# EAGLE design MCU Design exp neat (EAGLE 7.1.0)
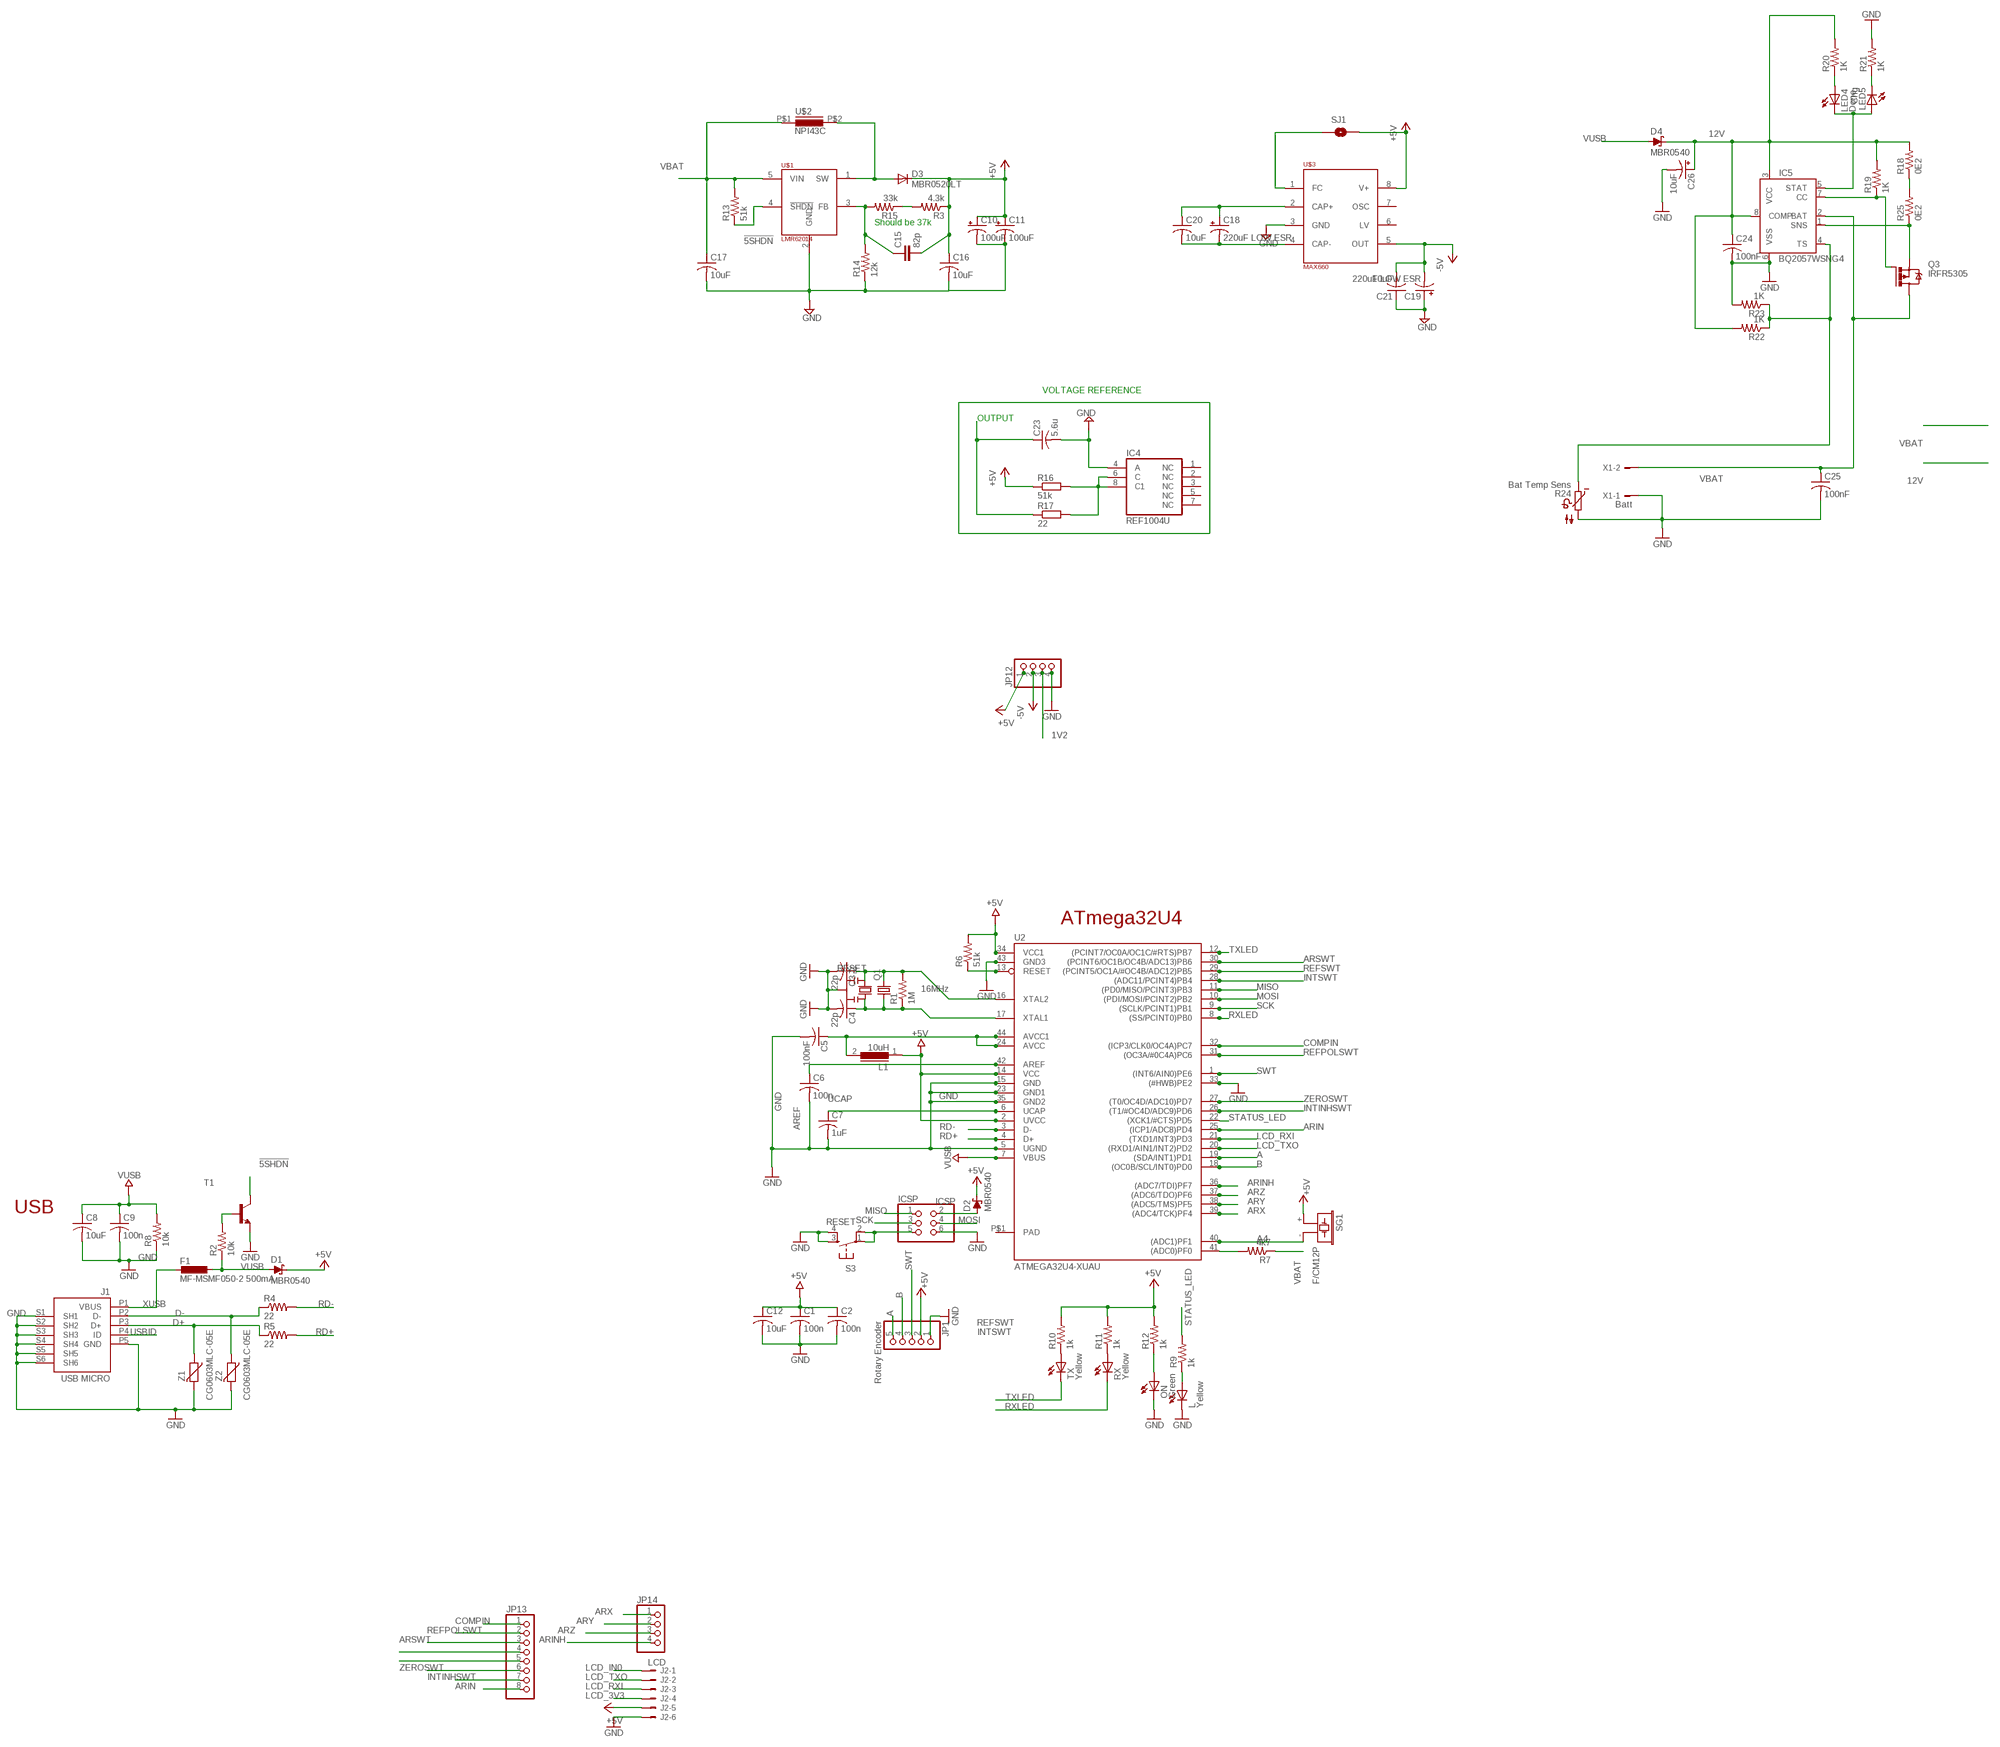
[diagram p0: schematic, sheet 1]

## Parts
C1  100n  C-USC0805  [C0805]
C2  100n  C-USC0805  [C0805]
C3  22p  C-USC0805  [C0805]
C4  22p  C-USC0805  [C0805]
C5  100nF  C-USC0805  [C0805]
C6  100n  C-USC0805  [C0805]
C7  1uF  C-USC0805  [C0805]
C8  10uF  C-USC0805  [C0805]
C9  100n  C-USC0805  [C0805]
C10  100uF  CPOL-USD  [PANASONIC_D]
C11  100uF  CPOL-USD  [PANASONIC_D]
C12  10uF  C-USC0805  [C0805]
C15  82p  C-EUC0805  [C0805]
C16  10uF  C-USC0805  [C0805]
C17  10uF  C-USC0805  [C0805]
C18  220uF LOW ESR  CPOL-USD  [PANASONIC_D]
C19  220uF LOW ESR  CPOL-USD  [PANASONIC_D]
C20  10uF  C-USC0805  [C0805]
C21  10uF  C-USC0805  [C0805]
C23  5.6u  C-USC0805K  [C0805K]
C24  100nF  C-USC0805K  [C0805K]
C25  100nF  C-USC0805K  [C0805K]
C26  10uF  CPOL-US153CLV-0405  [153CLV-0405]
D1  MBR0540  [SOD123@2]
D2  MBR0540  [SOD123@2]
D3  MBR0520LT  [SOD123]
D4  MBR0540  [SOD123@2]
F1  MF-MSMF050-2 500mA  L-EUL1812  [L1812]
IC4  REF1004U  [SO08]
IC5  BQ2057WSNG4  [D_R-PDSO-G8]
ICSP  ICSP  PINHD-2X3  [2X03]
J1  USB MICRO  MYCON2_USB-MINI-B  [CON2_USB_MICRO_B_AT]
J2  LCD  22-05-7068-06  [7395-06]
JP1  Rotary Encoder  PINHD-1X5  [1X05]
JP12  PINHD-1X4  [1X04]
JP13  PINHD-1X8  [1X08]
JP14  PINHD-1X4  [1X04]
L  Yellow  LEDCHIPLED_0805  [CHIPLED_0805]
L1  10uH  MMICC7  [MMICC7]
LED4  Done  LEDCHIPLED_0805  [CHIPLED_0805]
LED5  Chg  LEDCHIPLED_0805  [CHIPLED_0805]
ON  Green  LEDCHIPLED_0805  [CHIPLED_0805]
Q1  CRYSTALHC49UP  [HC49UP]
Q3  IRFR5305  [D-PAK_TO252AA]
R1  1M  R-US_R0805  [R0805]
R2  10k  R-US_R0805  [R0805]
R3  4.3k  R-US_R0805  [R0805]
R4  22  R-US_R0805  [R0805]
R5  22  R-US_R0805  [R0805]
R6  51k  R-US_R0805  [R0805]
R7  4k7  R-US_R0805  [R0805]
R8  10k  R-US_R0805  [R0805]
R9  1k  R-US_R0805  [R0805]
R10  1k  R-US_R0805  [R0805]
R11  1k  R-US_R0805  [R0805]
R12  1k  R-US_R0805  [R0805]
R13  51k  R-US_R0805  [R0805]
R14  12k  R-US_R0805  [R0805]
R15  33k  R-US_R0805  [R0805]
R16  51k  R-EU_M0805  [M0805]
R17  22  R-EU_M0805  [M0805]
R18  0E2  R-US_M1206  [M1206]
R19  1K  R-US_R0805  [R0805]
R20  1K  R-US_R0805  [R0805]
R21  1K  R-US_R0805  [R0805]
R22  1K  R-US_R0805  [R0805]
R23  1K  R-US_R0805  [R0805]
R24  Bat Temp Sens  NTC640  [P640]
R25  0E2  R-US_M1206  [M1206]
RX  Yellow  LEDCHIPLED_0805  [CHIPLED_0805]
S3  RESET  TAC_SWITCHSMD  [TACTILE_SWITCH_SMD]
SG1  F/CM12P  [F/CM12P]
SJ1  SOLDERJUMPERTRACE  [SJ_2S-TRACE]
T1  MMBT2222ALT1-NPN-SOT23-BEC  [SOT23-BEC]
TX  Yellow  LEDCHIPLED_0805  [CHIPLED_0805]
U2  ATMEGA32U4-XUAU  [TQFP44-PAD]
U$1  LMR62014  [SOT23-5]
U$2  NPI43C  [NPI43C]
U$3  MAX660  [SO08]
X1  Batt  22-23-2021  [22-23-2021]
Y2  16MHz  RESONATORMU  [RESONATOR]
Z1  CG0603MLC-05E  VARISTORCN0603  [CT/CN0603]
Z2  CG0603MLC-05E  VARISTORCN0603  [CT/CN0603]

## Nets
1V2: C23.1 JP12.3 R17.1
12V: C24.1 C26.+ D4.C IC5.3(VCC) IC5.8(COMP) R18.2 R19.2 R20.2 R22.2
!5SHDN: R13.1 T1.C U$1.4(!SHDN)
+5V [usbvcc]: C1.1 C2.1 C10.+ C11.+ C12.1 C15.2 C16.1 D1.C D2.C D3.C J2.5 JP1.2 JP12.1 L1.1 R3.1 R6.2 R10.2 R11.2 R12.2 R16.1 SG1.+ SJ1.2 U2.2(UVCC) U2.14(VCC) U2.34(VCC1) U$3.8(V+)
-5V: C19.- C21.2 JP12.2 U$3.5(OUT)
A: JP1.5 U2.19((SDA/INT1)PD1)
A4: SG1.- U2.40((ADC1)PF1)
AREF [aref]: C6.1 U2.42(AREF)
ARIN: JP13.8 U2.25((ICP1/ADC8)PD4)
ARINH: JP14.4 U2.36((ADC7/TDI)PF7)
ARSWT: JP13.3 U2.30((PCINT6/OC1B/OC4B/ADC13)PB6)
ARX: JP14.1 U2.39((ADC4/TCK)PF4)
ARY: JP14.2 U2.38((ADC5/TMS)PF5)
ARZ: JP14.3 U2.37((ADC6/TDO)PF6)
AVCC: C5.1 L1.2 U2.24(AVCC) U2.44(AVCC1)
B: JP1.4 U2.18((OC0B/SCL/INT0)PD0)
COMPIN: JP13.1 U2.32((ICP3/CLK0/OC4A)PC7)
D+: J1.P3(D+) R5.1 Z1.1
D-: J1.P2(D-) R4.1 Z2.1
GND [gnd]: C1.2 C2.2 C3.2 C4.2 C5.2 C6.2 C7.2 C8.2 C9.2 C10.- C11.- C12.2 C16.2 C17.2 C19.+ C21.1 C23.2 C24.2 C25.2 C26.- IC4.4(A) IC5.6(VSS) ICSP.6 J1.P5(GND) J1.S1(SH1) J1.S2(SH2) J1.S3(SH3) J1.S4(SH4) J1.S5(SH5) J1.S6(SH6) J2.6 JP1.1 JP12.4 L.C ON.C R8.1 R14.1 R21.2 R23.2 R24.2 S3.3 S3.4 T1.E U2.5(UGND) U2.15(GND) U2.23(GND1) U2.33((#HWB)PE2) U2.35(GND2) U2.43(GND3) U$1.2(GND) U$3.3(GND) X1.1 Y2.2 Z1.2 Z2.2
INTINHSWT: JP13.7 U2.26((T1/#OC4D/ADC9)PD6)
INTSWT: JP13.5 U2.28((ADC11/PCINT4)PB4)
LCD_3V3: J2.4
LCD_IN0: J2.1
LCD_RXI: J2.3 U2.21((TXD1/INT3)PD3)
LCD_TXO: J2.2 U2.20((RXD1/AIN1/INT2)PD2)
MISO: ICSP.1 U2.11((PD0/MISO/PCINT3)PB3)
MOSI: ICSP.4 U2.10((PDI/MOSI/PCINT2)PB2)
N$1: R10.1 TX.A
N$2: L.A R9.1
N$3: ON.A R12.1
N$4: R11.1 RX.A
N$5: C18.+ C20.1 U$3.2(CAP+)
N$6: R7.2 U2.41((ADC0)PF0)
N$7: IC4.6(C) IC4.8(C1) R16.2 R17.2
N$8: R2.2 T1.B
N$10 [usbvcc]: D2.A ICSP.2
N$11: R3.2 R15.1
N$12: IC5.5(STAT) LED4.C LED5.A
N$14: LED4.A R20.1
N$15: R18.1 R25.2
N$16: C18.- C20.2 U$3.4(CAP-)
N$17: C15.1 R14.2 R15.2 U$1.3(FB)
N$19: SJ1.1 U$3.1(FC)
N$23: ICSP.5 S3.1 S3.2
N$27: IC5.1(SNS) Q3.3(S) R25.1
N$29: IC5.7(CC) Q3.1(G) R19.1
N$30: LED5.C R21.1
N$32: IC5.4(TS) R22.1 R23.1 R24.1
RD+: R5.2 U2.4(D+)
RD-: R4.2 U2.3(D-)
REFPOLSWT: JP13.2 U2.31((OC3A/#0C4A)PC6)
REFSWT: JP13.4 U2.29((PCINT5/OC1A/#OC4B/ADC12)PB5)
RESET: R6.1 U2.13(RESET)
RXLED: RX.C U2.8((SS/PCINT0)PB0)
SCK: ICSP.3 U2.9((SCLK/PCINT1)PB1)
STATUS_LED: R9.2 U2.22((XCK1/#CTS)PD5)
SW: D3.A U$1.1(SW) U$2.P$2
SWT: JP1.3 U2.1((INT6/AIN0)PE6)
TXLED: TX.C U2.12((PCINT7/OC0A/OC1C/#RTS)PB7)
UCAP: C7.1 U2.6(UCAP)
USBID: J1.P4(ID)
VBAT: C17.1 C25.1 IC5.2(BAT) Q3.4(D) R7.1 R13.2 U$1.5(VIN) U$2.P$1 X1.2
VUSB: C8.1 C9.1 D1.A D4.A F1.1 R2.1 R8.2 U2.7(VBUS)
XTAL1: C4.1 Q1.1 R1.1 U2.17(XTAL1) Y2.3
XTAL2: C3.1 Q1.2 R1.2 U2.16(XTAL2) Y2.1
XUSB [usbvcc]: F1.2 J1.P1(VBUS)
ZEROSWT: JP13.6 U2.27((T0/OC4D/ADC10)PD7)
Unconnected: IC4.1(NC) IC4.2(NC) IC4.3(NC) IC4.5(NC) IC4.7(NC) U$3.6(LV) U$3.7(OSC)

## Notes on the sheet
- Should be 37k
- VOLTAGE REFERENCE
- OUTPUT
- ATmega32U4
- USB

## Power pins joined to a net without a drawn wire
PAD: U2.P$1(PAD)

## Library data of the parts
C1-C9 C12 C16 C17 C20 C21 C24 C25 = resistor:C-US: CAPACITOR, American symbol
C10 C11 C18 C19 C26 = resistor:CPOL-US: POLARIZED CAPACITOR, American symbol
C15 = resistor:C-EU: CAPACITOR, European symbol
C23 = rcl:C-US: CAPACITOR, American symbol
D1 D2 D4 = diode:MBR0540: schottky diode, 0.5A, 40V ON Semiconductor
D3 = diode:MBR0520LT: SCHOTTKY BARRIER RECTIFIER Source: http://onsemi.com .. MBR0520LT1-D.pdf
F1 = rcl:L-EU: INDUCTOR, European symbol
IC4 = burr-brown:REF1004: Micropower Voltage Reference; MF: TEXAS INSTRUMENTS; MPN: REF1004C-1.2; OC_FARNELL: 1296022; OC_NEWARK: 75C7399
IC5 = RobThePyro:BQ2057WSNG4: TI BQ2057WSNG4 1-2Cell Li-ion / lipo charger IC http://www.ti.com/lit/ds/symlink/bq2057w.pdf
ICSP = SmartPrj:PINHD-2X3: PIN HEADER
J1 = SmartPrj:MYCON2_USB-MINI-B
J2 = con-molex:22-?-06: CONNECTOR wire to board 2.54 mm (.1 inch) pitch header; OC_FARNELL: unknown; OC_NEWARK: unknown
JP1 = pinhead:PINHD-1X5: PIN HEADER
JP12 JP14 = pinhead:PINHD-1X4: PIN HEADER
JP13 = pinhead:PINHD-1X8: PIN HEADER
L LED4 LED5 ON RX TX = led:LED: LED OSRAM: - CHIPLED LG R971, LG N971, LY N971, LG Q971, LY Q971, LO R971, LY R971 LH N974, LH R974 LS Q976, LO Q976, LY Q976 LO Q996 - Hyper CHIPLED LW Q18S LB Q993, LB Q99A, LB R99A - SideLED LS A670, LO A670, LY A670, LG A670, LP A670 LB A673, LV A673, LT A673, LW A673 LH A674 LY A675 LS A676, LA A676, LO A676, LY A676, LW A676 LS A679, LY A679, LG A679 - Hyper Micro SIDELED® LS Y876, LA Y876, LO Y876, LY Y876 LT Y87S - SmartLED LW L88C, LW L88S LB L89C, LB L89S, LG L890 LS L89K, LO L89K, LY L89K LS L896, LA L896, LO L896, LY L896 - TOPLED LS T670, LO T670, LY T670, LG T670, LP T670 LSG T670, LSP T670, LSY T670, LOP T670, LYG T670 LG T671, LOG T671, LSG T671 LB T673, LV T673, LT T673, LW T673 LH T674 LS T676, LA T676, LO T676, LY T676, LB T676, LH T676, LSB T676, LW T676 LB T67C, LV T67C, LT T67C, LS T67K, LO T67K, LY T67K, LW E67C LS E67B, LA E67B, LO E67B, LY E67B, LB E67C, LV E67C, LT E67C LW T67C LS T679, LY T679, LG T679 LS T770, LO T770, LY T770, LG T770, LP T770 LB T773, LV T773, LT T773, LW T773 LH T774 LS E675, LA E675, LY E675, LS T675 LS T776, LA T776, LO T776, LY T776, LB T776 LHGB T686 LT T68C, LB T68C - Hyper Mini TOPLED® LB M676 - Mini TOPLED Santana® LG M470 LS M47K, LO M47K, LY M47K Source: http://www.osram.convergy.de LUXEON: - LUMILED® LXK2-PW12-R00, LXK2-PW12-S00, LXK2-PW14-U00, LXK2-PW14-V00 LXK2-PM12-R00, LXK2-PM12-S00, LXK2-PM14-U00 LXK2-PE12-Q00, LXK2-PE12-R00, LXK2-PE12-S00, LXK2-PE14-T00, LXK2-PE14-U00 LXK2-PB12-K00, LXK2-PB12-L00, LXK2-PB12-M00, LXK2-PB14-N00, LXK2-PB14-P00, LXK2-PB14-Q00 LXK2-PR12-L00, LXK2-PR12-M00, LXK2-PR14-Q00, LXK2-PR14-R00 LXK2-PD12-Q00, LXK2-PD12-R00, LXK2-PD12-S00 LXK2-PH12-R00, LXK2-PH12-S00 LXK2-PL12-P00, LXK2-PL12-Q00, LXK2-PL12-R00 Source: www.luxeon.com KINGBRIGHT: KA-3528ASYC Source: www.kingbright.com
L1 = inductors:MMICC7: INDUCTOR
Q1 = crystal:CRYSTAL: CRYSTAL; OC_FARNELL: unknown; OC_NEWARK: unknown
Q3 = transistor-power:IRF?5305: HEXFET Power MOSFET Source: http://www.irf.com/product-info/datasheets/data/irfr5305pbf.pdf
R1-R15 R18-R23 R25 = resistor:R-US_: RESISTOR, American symbol
R16 R17 = resistor:R-EU_: RESISTOR, European symbol
R24 = ptc-ntc:NTC640: PHILIPS NTC; OC_FARNELL: unknown; OC_NEWARK: unknown
S3 = SparkFun:TAC_SWITCH: Momentary Switch Button commonly used for reset or general input. Spark Fun Electronics SKU : COM-00097
SG1 = buzzer:F/CM12P: BUZZER Source: Buerklin; OC_FARNELL: unknown; OC_NEWARK: unknown
SJ1 = SparkFun:SOLDERJUMPER: Solder Jumper Standard SMD solder jumper. Used to automate production. Two varients : Normally Open and Normally Closed are the same, but have different paste layers. NC will have a large amount of paste and should jumper during reflow.
T1 = transistor-neu-to92:*-NPN-: NPN Transistror
U2 = SmartPrj:ATMEGA32U4-XU
U$1 = RobThePyro:LMR62014
U$2 = RobThePyro:NPI43C
U$3 = RobThePyro:MAX660
X1 = con-molex:22-23-2021: .100" (2.54mm) Center Header - 2 Pin; MF: MOLEX; MPN: 22-23-2021; OC_FARNELL: 1462926; OC_NEWARK: 25C3832
Y2 = SmartPrj:RESONATOR
Z1 Z2 = varistor:VARISTOR: VARISTOR

## Net classes
0 default: width 0.152 mm, drill 0.305 mm, clearance 0.152 mm
1 power: width 0.254 mm, drill 0.61 mm, clearance 0.254 mm
2 gnd: width 0.254 mm, drill 0.61 mm, clearance 0.254 mm
3 usbvcc: width 0.254 mm, drill 0.61 mm, clearance 0.254 mm
4 aref: width 0.254 mm, drill 0.61 mm, clearance 0.254 mm

## Board
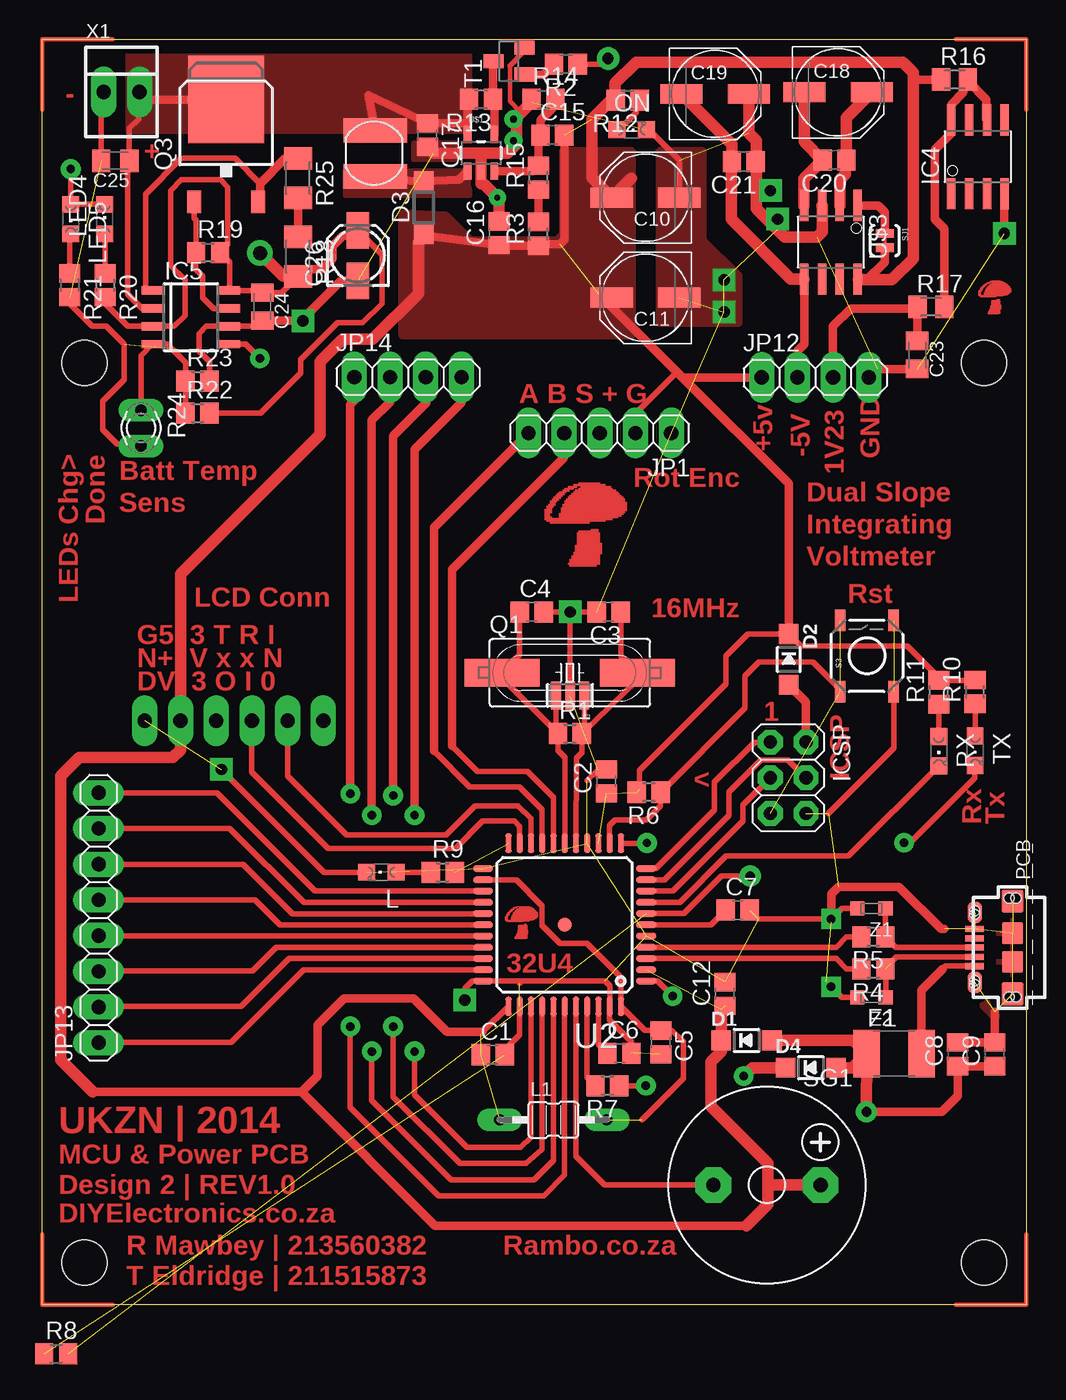
[diagram p1: board, top side]
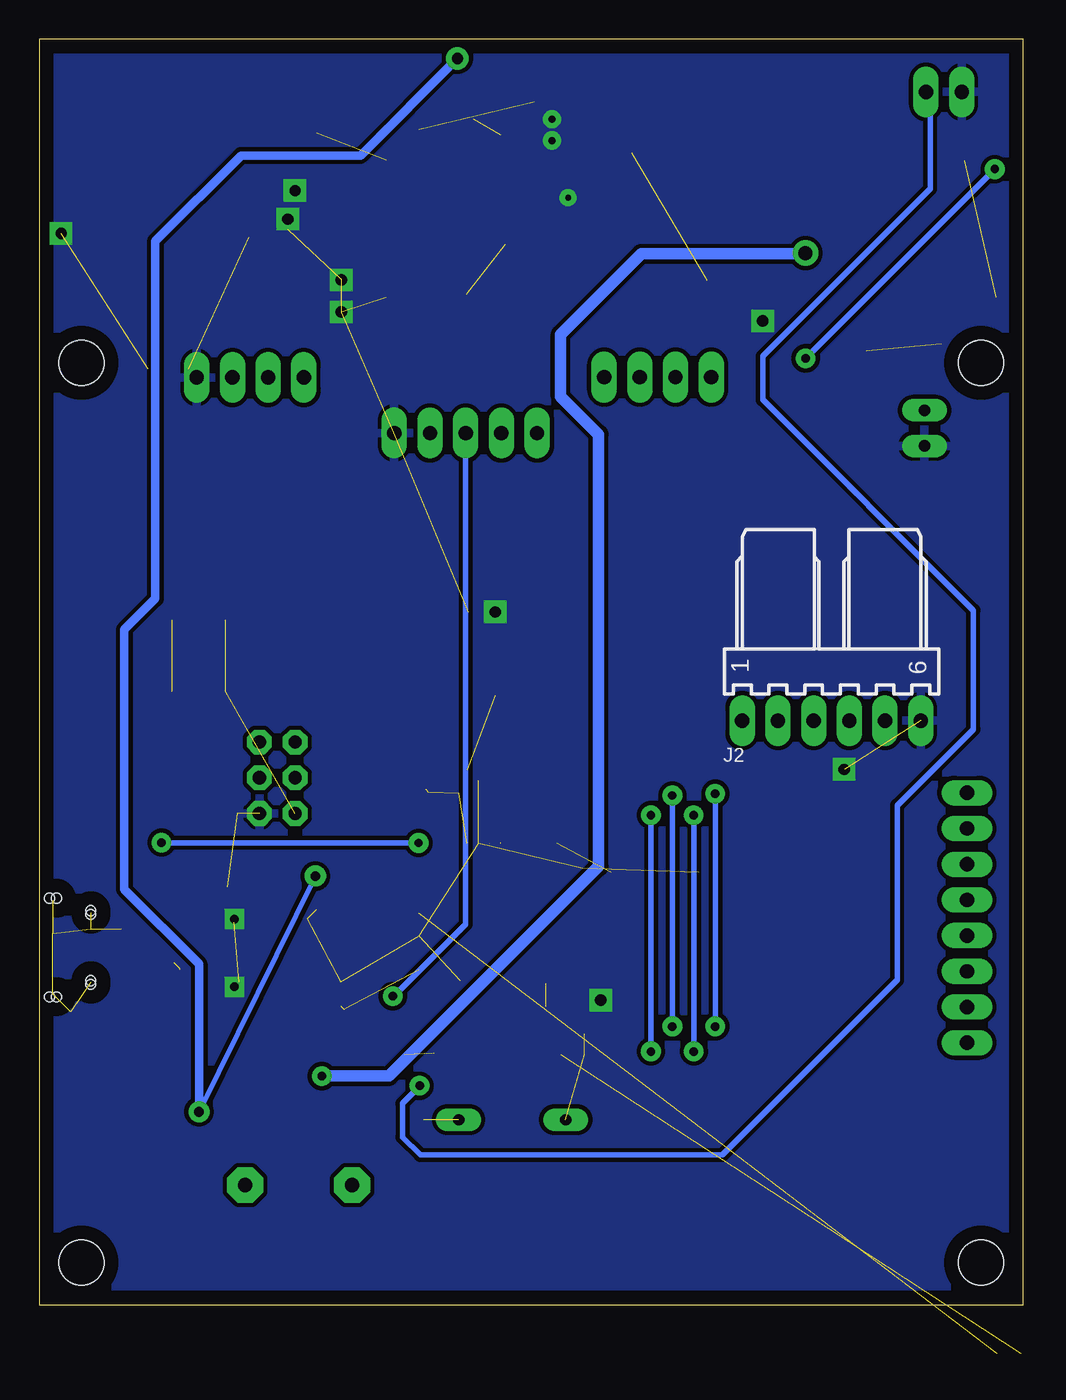
[diagram p2: board, bottom side, seen from below]

Size 70 x 90 mm. Coordinates in mm from the lower left corner, seen from the top.
Outline: 0,0 0,90 70,90 70,0 0,0
Copper layers (1*16): Top 0.035mm / dielectric 1.5mm / Bottom 0.035mm
Design rules "RobThePyro_home *": minimum track width 0.4mm, minimum drill 0.6mm, track to track 0.3mm, track to pad 0.2mm, pad to pad 0.3mm, via to via 0.3mm, smd to smd 8mil, copper to edge 40mil, drill to drill 8mil, minimum pad ring 0.4mm, minimum via ring 0.4mm, stop-mask expansion 4mil, vias tented up to drill 0mil, thermal gap 10mil
Holes 3.2 mm at 3,3 67,3 67,67 3,67

### Footprints (pad centres in the part's own frame; a part is rotated, then mirrored left to right if it is on the bottom)
C0805 = smd 1.3 x 1.5: 1 -0.85,0; 2 0.85,0
PANASONIC_D = smd 3 x 1.4: + 2.4,0; - -2.4,0
C0805K = smd 1.3 x 1.6: 1 -1,0; 2 1,0
153CLV-0405 = smd 2.6 x 1.6: + 1.8,0; - -1.8,0
SOD123@2 = smd 1.4 x 1.4: A 1.805,0; C -1.805,0
SOD123 = smd 1.4 x 1.4: A 1.9,0; C -1.9,0
L1812 = smd 1.9 x 3.4: 1 -1.95,0; 2 1.95,0
SO08 = smd 0.61 x 2.21: 1 -1.905,-2.616; 2 -0.635,-2.616; 3 0.635,-2.616; 4 1.905,-2.616; 5 1.905,2.616; 6 0.635,2.616; 7 -0.635,2.616; 8 -1.905,2.616
D_R-PDSO-G8 = smd 0.6 x 1.5: 1 -1.905,-2.75; 2 -0.635,-2.75; 3 0.635,-2.75; 4 1.905,-2.75; 5 1.905,2.75; 6 0.635,2.75; 7 -0.635,2.75; 8 -1.905,2.75
2X03 = drill 0.95 pad 1.55 octagon: 1 -2.54,-1.27; 2 -2.54,1.27; 3 0,-1.27; 4 0,1.27; 5 2.54,-1.27; 6 2.54,1.27
CON2_USB_MICRO_B_AT = smd 0.406 x 1.346: P1 -1.321,2.692; P2 -0.66,2.692; P3 0,2.692; P4 0.66,2.692; P5 1.321,2.692 | smd 1.651 x 1.549: S1 -3.302,0; S2 3.302,0 | smd 1.524 x 1.016: S3 -2.489,2.692; S4 2.489,2.692 | smd 1.524 x 1.524: S5 -1.016,0; S6 1.016,0 | hole 0.7: -3.505,0.254; -3.505,-0.254; 3.505,0.254; 3.505,-0.254; -2.616,2.692; -2.362,2.692; 2.362,2.692; 2.616,2.692
7395-06 = drill 1.016 long: 1 6.35,0; 2 3.81,0; 3 1.27,0; 4 -1.27,0; 5 -3.81,0; 6 -6.35,0
1X05 = drill 1.016 long: 1 -5.08,0; 2 -2.54,0; 3 0,0; 4 2.54,0; 5 5.08,0
1X04 = drill 1.016 long: 1 -3.81,0; 2 -1.27,0; 3 1.27,0; 4 3.81,0
1X08 = drill 1.016 long: 1 -8.89,0; 2 -6.35,0; 3 -3.81,0; 4 -1.27,0; 5 1.27,0; 6 3.81,0; 7 6.35,0; 8 8.89,0
CHIPLED_0805 = smd 1.2 x 1.2: A 0,-1.05; C 0,1.05
MMICC7 = drill 0.813 long: 1 -3.81,0; 2 3.81,0
HC49UP = smd 5.334 x 1.93: 1 -4.826,0; 2 4.826,0
D-PAK_TO252AA = smd 1 x 1.6: 1 -2.28,-4.8; 3 2.28,-4.8 | smd 5.4 x 6.2: 4 0,2.5
R0805 = smd 1.3 x 1.5: 1 -0.85,0; 2 0.85,0
M0805 = smd 1.3 x 1.6: 1 -0.95,0; 2 0.95,0
M1206 = smd 1.6 x 2: 1 -1.4,0; 2 1.4,0
P640 = drill 0.813 long: 1 -1.27,0; 2 1.27,0
TACTILE_SWITCH_SMD = smd 1.524 x 0.762: 1 -2.54,1.905; 2 2.54,1.905; 3 -2.54,-1.905; 4 2.54,-1.905
F/CM12P = drill 1.016 pad 2.54 octagon: + 3.81,0; - -3.81,0
SJ_2S-TRACE = smd 0.635 x 1.27: 1 -0.508,0; 2 0.508,0
SOT23-BEC = smd 1 x 1.4: B -0.95,-1.1; C 0,1.1; E 0.95,-1.1
TQFP44-PAD = smd 1.4 x 0.45: 1 -5.8,4; 2 -5.8,3.2; 3 -5.8,2.4; 4 -5.8,1.6; 5 -5.8,0.8; 6 -5.8,0; 7 -5.8,-0.8; 8 -5.8,-1.6; 9 -5.8,-2.4; 10 -5.8,-3.2; 11 -5.8,-4; 23 5.8,-4; 24 5.8,-3.2; 25 5.8,-2.4; 26 5.8,-1.6; 27 5.8,-0.8; 28 5.8,0; 29 5.8,0.8; 30 5.8,1.6; 31 5.8,2.4; 32 5.8,3.2; 33 5.8,4 | smd 0.45 x 1.4: 12 -4,-5.8; 13 -3.2,-5.8; 14 -2.4,-5.8; 15 -1.6,-5.8; 16 -0.8,-5.8; 17 0,-5.8; 18 0.8,-5.8; 19 1.6,-5.8; 20 2.4,-5.8; 21 3.2,-5.8; 22 4,-5.8; 34 4,5.8; 35 3.2,5.8; 36 2.4,5.8; 37 1.6,5.8; 38 0.8,5.8; 39 0,5.8; 40 -0.8,5.8; 41 -1.6,5.8; 42 -2.4,5.8; 43 -3.2,5.8; 44 -4,5.8 | smd 1 x 1: P$1 0,0
SOT23-5 = smd 0.55 x 1.2: 1 -0.95,-1.3; 2 0,-1.3; 3 0.95,-1.3; 4 0.95,1.3; 5 -0.95,1.3
NPI43C = smd 1.75 x 4.5: P$1 -1.61,0.1; P$2 1.66,0.1
22-23-2021 = drill 1 long: 1 -1.27,0; 2 1.27,0
RESONATOR = smd 0.7 x 2: 1 -1,0; 2 0,0; 3 1,0
CT/CN0603 = smd 1 x 1: 1 -1,0; 2 1,0

### Placement (x,y rotation side)
C1  32.06,17.78 0 top
C2  40.13,37.21 90 top
C3  40.31,49.28 180 top
C4  34.82,49.28 0 top
C5  44.02,18.64 270 top
C6  41.07,17.88 0 top
C7  49.48,28.07 0 top
C8  65.13,17.81 90 top
C9  67.77,17.81 90 top
C10  42.93,78.74 180 top
C11  42.93,71.63 180 top
C12  48.57,22.1 90 top
C15  36.3,83.19 0 top
C16  32.49,76.21 90 top
C17  27.41,83.19 270 top
C18  56.62,86.24 0 top
C19  47.89,86.13 0 top
C20  56.36,81.41 180 top
C21  49.92,81.3 180 top
C23  62.25,67.56 270 top
C24  15.66,70.99 270 top
C25  5.21,81.36 180 top
C26  22.46,74.63 90 top
D1  50.11,18.8 0 top
D2  53.11,45.9 270 top
D3  27.15,78.03 90 top
D4  54.69,16.86 0 top
F1  60.6,17.86 0 top
IC4  66.57,81.65 0 top
IC5  10.58,70.23 270 top
ICSP  53.08,37.48 270 top
J1  69.04,25.4 90 top
J2  13.65,41.54 180 bottom
JP1  39.67,62 180 top
JP12  55,65.96 0 top
JP13  4.02,27.52 90 top
JP14  26.02,65.98 0 top
L  24.14,30.76 90 top
L1  36.37,13.14 0 top
LED4  4.45,77.22 0 top
LED5  2.03,77.22 180 top
ON  41.95,83.56 270 top
Q1  37.54,44.95 0 top
Q3  13.08,83.23 0 top
R1  37.54,40.61 0 top
R2  37.26,88.25 180 top
R3  35.31,76.16 90 top
R4  59.13,23.88 180 top
R5  59.13,26.16 180 top
R6  43.16,36.45 180 top
R7  40.21,15.57 180 top
R8  1,-3.5 0 top  (outside the outline)
R9  28.5,30.75 0 top
R10  66.37,43.59 90 top
R11  63.78,43.56 90 top
R12  41.66,85.68 180 top
R13  31.22,85.73 180 top
R14  35.66,85.73 0 top
R15  35.31,80.16 90 top
R16  64.9,87.15 0 top
R17  63.24,70.97 0 top
R18  18.2,74.55 270 top
R19  11.81,74.85 0 top
R20  4.49,72.52 270 top
R21  1.95,72.52 270 top
R22  11.05,63.42 0 top
R23  11.05,65.7 0 top
R24  7.03,62.36 270 top
R25  18.2,80.14 270 top
RX  63.78,39.37 180 top
S3  58.67,46.15 90 top
SG1  51.56,8.51 0 top
SJ1  59.94,75.69 270 top
T1  33.21,88.46 90 top
TX  66.37,39.4 180 top
U2  37.17,27.02 180 top
U$1  31.22,81.92 0 top
U$2  23.6,81.92 270 top
U$3  56.11,75.57 180 top
X1  5.65,86.26 0 top
Y2  37.57,43.33 180 top
Z1  59.01,28.19 180 top
Z2  59.01,21.84 180 top

### Tracks (layer width: path | path; a pad name or v marks a point on that pad's centre or on a via)
1V2
  Top 0.61: JP12.3 56.26,69.6 57.53,70.87 62.19,70.87 R17.1 62.25,70.94 C23.1
12V  (via drill 0.6, 1)
  Top 0.406: 12.7,74.88 R19.2 | R19.2 13.33,74.17 IC5.8 15.52,72.14 C24.1 17.05,71.99 R18.2 | R19.2 13.21,75.39 13.21,79.5 12.7,80.01 9.91,80.01 9.14,79.25 9.14,73.91 10.16,72.9 10.16,70.36 9.4,69.59 IC5.3 6.1,69.6 4.49,71.2 R20.2 | R22.2 15.54,63.42 18.39,66.27 18.39,67.26 18.41,67.26 21.01,69.85 22.81,69.85 24.18,71.22 24.18,74.71 22.84,76.05
  Top 0.61: C26.+ 22.84,76.05 21.41,76.05 20.68,75.31 20.68,74.42 19.91,73.66 18.72,73.66 R18.2
  Top 0.813: R18.2 17.15,73.15 v15.49,74.8 | D4.C 50.51,16.86 v49.91,16.26
  Bottom 0.813: v49.91,16.26 45.14,16.26 30.23,31.17 30.23,61.9 32.92,64.59 32.92,69.01 27.18,74.75 15.54,74.75 v15.49,74.8
!5SHDN
  Top 0.61: U$1.4 32.17,85.63 R13.1 32.07,88.16 T1.C
+5V  (9 unrouted)
  Top 0.406: R10.2 66.35,44.41 R11.2 63.78,44.6 61.54,46.84 53.98,46.84 D2.C 50.22,47.7 48.64,46.13 48.64,44.15 42.49,38 42.49,36.64 | U2.34 31.34,19.38 31.21,19.25 | JP1.2 42.22,63.37 45.17,66.33
  Top 0.61: D3.C 27.63,75.99 C16.1 32.53,75.31 R3.1 35.44,75.44 36.83,75.44 37.15,75.76 C15.2 | SJ1.2 59.94,74.17 58.67,72.9 58.07,72.9 U$3.8 | JP12.1 45.55,65.96 | 45.55,65.96 45.17,66.33 39.62,71.88 40.27,71.88 C11.+ | R16.1 62.25,87.15 61.98,86.87 | 18.44,15.14 27.96,5.61 50.11,5.61 | 18.44,15.14 3.58,15.14 | 18.44,15.14 19.58,16.28 19.58,19.89 21.46,21.77 26.42,21.77 28.8,19.38 31.34,19.38 | D2.C 53.11,58.4 45.55,65.96
  Top 0.813: D3.C 26.77,75.57 26.77,71.93 23.52,68.68 21.36,68.68 19.76,67.08 19.76,61.9 9.84,51.98 J2.5 9.84,39.46 9.3,38.91 2.64,38.91 1.32,37.59 1.32,17.4 3.58,15.14 | 58.07,72.9 60.45,72.9 61.98,74.42 61.98,86.87 61.98,87.63 61.21,88.39 42.29,88.39 40.77,86.87 40.77,85.72 | 41.91,80.12 C10.+ 39.12,80.15 39.12,84.33 40.51,85.72 40.77,85.72 | 40.77,85.72 R12.2 | 48.31,20.99 D1.C 48.31,18.01 47.57,17.27 47.57,14.1 51.64,10.03 51.64,8.53 | 51.64,8.53 51.64,7.14 50.11,5.61 | SG1.+ 51.66,8.51 51.64,8.53
  pour Top (no thermals): 25.65,77.6 28.7,77.47 30.48,75.69 38.86,75.69 38.86,68.96 25.65,68.96
  pour Top (no thermals): 36.83,75.95 37.08,75.95 37.08,82.04 41.91,82.04 41.91,68.96 36.83,68.96
-5V
  Top 0.61: JP12.2 53.73,67.83 54.23,68.33 54.23,72.93 U$3.5
  Top 0.813: U$3.5 53.28,72.96 49.02,77.22 49.02,81.26 C21.2 49.07,82.55 C19.-
A
  Top 0.406: U2.19 35.58,35.22 33.96,36.83 30.4,36.83 27.86,39.37
  Top 0.61: 27.86,39.37 27.86,55.27 JP1.5
A4
  Top 0.406: U2.40 37.97,10.54 40.01,8.51 SG1.-
AREF
  Top 0.406: U2.42 39.58,18.53 C6.1
ARIN
  Top 0.406: 4.05,36.45 JP13.8 12.44,36.41 19.43,29.41 U2.25
ARINH  (via drill 0.6)
  Top 0.406: U2.36 34.77,11.91 34.04,11.18 30.23,11.18 26.49,14.91 v26.49,18.01
  Top 0.61: v26.49,34.82 26.49,60.81 29.84,64.16 29.84,65.96 JP14.4
  Bottom 0.406: v26.49,34.82 v26.49,18.01
ARSWT
  Top 0.406: 4.05,23.75 JP13.3 4.03,23.72 14.96,23.72 16.66,25.42 U2.30
ARX  (via drill 0.6)
  Top 0.406: U2.39 37.17,9.23 35.69,7.75 28.19,7.75 21.92,14.02 v21.92,19.79
  Top 0.61: v21.92,36.35 21.92,64.01 22.21,64.3 JP14.1
  Bottom 0.406: v21.92,36.35 v21.92,19.79
ARY  (via drill 0.6)
  Top 0.406: U2.38 36.37,10.26 35,8.89 29.08,8.89 23.44,14.53 v23.44,18.01
  Top 0.61: v23.44,34.82 23.44,62.92 24.74,64.21 24.74,65.97 JP14.2
  Bottom 0.406: v23.44,34.82 v23.44,18.01
ARZ  (via drill 0.6)
  Top 0.406: U2.37 35.56,21.2 35.56,11.05 34.42,10.03 29.72,10.03 24.97,14.78 v24.97,19.79
  Top 0.61: v24.97,36.22 24.97,61.8 27.33,64.16 27.33,65.94 JP14.3
  Bottom 0.406: v24.97,36.22 v24.97,19.79
AVCC  (1 unrouted)
  Top 0.406: 42.66,13.14 45.62,16.1 45.62,18.72 44.86,19.48 C5.1 42.9,19.49 U2.44 41.17,23.27 38.76,25.68 36.85,25.68 35.56,26.98 35.56,28.37 33.73,30.2 31.39,30.2 U2.24
B
  Top 0.406: U2.18 36.38,36.07 34.52,37.92 30.99,37.92 29.16,39.75
  Top 0.61: 29.16,39.75 29.16,52.27 37.13,60.25 JP1.4
COMPIN
  Top 0.406: 4.05,18.67 JP13.1 4.03,18.64 13.44,18.64 18.61,23.82 U2.32
D+
  Top 0.406: J1.P3 60.74,25.4 R5.1 59.98,28.04 Z1.1
D-  (2 unrouted)
  Top 0.406: J1.P2 60.76,24.74 60.4,24.38 60.4,24.3 | Z2.1 60.01,23.85
GND  (via drill 0.4, 0.5, 0.6, 0.8)  (39 unrouted)
  Top 0.305: 33.27,88.14 33.27,85.6 34.08,84.79
  Top 0.406: R23.2 11.9,67.09 11.18,67.82 11.18,69.09 11.68,69.6 IC5.6 15.27,69.6 C24.2 | C25.2 4.21,86.09 X1.1 | R21.2 1.95,71.2 3.56,69.6 4.57,69.6 5.84,68.33 5.84,65.79 4.32,64.26 4.32,62.23 5.33,61.21 6.9,61.21 R24.2 | T1.E 34.29,89.15 33.27,88.14 | ON.C 43.18,83.56 45.34,81.41 45.34,78.75 C10.- | v18.54,69.98 18.43,69.98 18.41,69.99 | Z1.2 56.9,28.19 v56.13,27.43 50.97,27.43 | Z2.2 56.9,21.84 v56.13,22.61 55.79,22.95 | 33.96,21.2 33.96,19.18 32.91,18.12 C1.2 | Y2.2 v37.57,49.28 | v37.57,49.28 C4.2 | C3.2 v37.57,49.28 | 41.94,17.89 41.94,18.69 40.38,20.25 U2.43 40.39,22.66 40.02,23.02 34.14,23.02 | 34.14,23.02 U2.33 30.61,23.02 30.07,22.48 v30.07,21.67 | 33.98,22.86 34.14,23.02 | 38.77,37.28 39.55,38.05 40.25,38.05 C2.2 | L.C 20.07,30.76 v12.75,38.08 | 55.92,34.94 60.58,39.6 S3.3
  Top 0.61: C17.2 27.83,81.92 | R14.1 34.81,85.52 | C8.2 C9.2 67.77,20.83 | v33.53,82.8 33.76,82.8 | v33.53,84.33 33.76,84.33 | C24.2 18.41,69.99 21.25,72.83 C26.- | v51.82,79.25 51.05,79.25 50.8,78.99 | v52.32,77.22 52.32,76.45 | IC4.4 68.45,79.01 v68.45,76.2 | C23.2 59.41,66.56 JP12.4 | 64.19,26.72 63.96,26.72 60.96,29.72 56.64,29.72 56.13,29.21 v56.13,27.43
  Top 0.813: 27.83,81.92 31.22,81.92 | 31.22,81.92 U$1.2 31.22,79.72 31.4,79.72 v32.38,78.74 32.49,78.64 C16.2 | 34.81,85.52 34.08,84.79 33.76,84.46 33.76,84.33 33.76,82.8 33.76,82.56 33.12,81.92 31.22,81.92 | C19.+ 50.29,83.32 50.8,82.8 50.8,81.33 | 50.8,81.33 C21.1 | 50.8,81.33 50.8,78.99 50.8,77.98 52.32,76.45 52.83,75.95 55.12,75.95 55.5,76.33 55.5,78.17 U$3.3
  Bottom 0.406: v56.13,27.43 56.13,27.18 | v56.13,22.61 56.13,22.35
  other vias: 48.51,72.9 48.51,70.61
  pour Top (no thermals): 29.44,82.68 26.39,82.68 26.39,81.41 29.44,81.41
  pour Top (no thermals): 43.94,70.61 43.94,82.04 46.99,82.04 46.99,75.69 49.53,73.15 49.53,69.85 43.94,69.85 43.94,70.36
  pour Bottom: 0,0 0,90 70,90 70,0
  pour Top: 65.79,23.11 65.79,22.35 67.56,20.57 69.85,20.57 69.85,30.23 67.56,30.23 65.79,28.45 65.79,27.43 67.56,27.43 68.07,26.92 68.07,24.13 68.07,23.88 67.56,23.37 65.79,23.37
INTINHSWT
  Top 0.406: 4.05,33.91 JP13.7 13.35,33.87 18.62,28.6 31.36,28.6 U2.26
INTSWT
  Top 0.406: 4.05,28.83 JP13.5 15.15,28.79 16.92,27.03 U2.28
LCD_RXI
  Top 0.406: U2.21 33.98,34.02 33.6,34.39 31.34,34.39 29.41,32.46 20.34,32.46 14.91,37.9 J2.3
LCD_TXO
  Top 0.406: U2.20 34.77,34.57 33.86,35.48 30.79,35.48 28.73,33.43 21.64,33.43 17.45,37.62 J2.2
MISO
  Top 0.406: U2.11 43.67,31.02 47.83,35.18 47.83,37.16 50.67,40.01 51.8,40.01 ICSP.1
MOSI
  Top 0.406: U2.10 44.27,30.22 48.84,34.8 48.84,36.48 51.13,38.76 53.07,38.76 ICSP.4
N$1
  Top 0.406: TX.A R10.1
N$2
  Top 0.406: R9.1 L.A
N$3
  Top 0.406: ON.A 41.02,83.56 42.29,84.84 42.29,85.47 R12.1
N$4
  Top 0.406: RX.A R11.1
N$5
  Top 0.813: U$3.2 56.74,80.02 57.13,80.4 57.13,81.33 C20.1 57.21,84.44 C18.+
N$6
  Top 0.406: U2.41 38.77,16.15 R7.2
N$7
  Top 0.61: IC4.6 67.18,84.29 67.18,85.72 65.86,87.05 R16.2 65.53,86.82 65.53,86.23 64.67,85.37 IC4.8 64.67,83.34 63.5,82.17 63.5,77.22 64.19,76.53 R17.2
N$8
  Top 0.61: T1.B 35.67,87.51 R2.2
N$9
  Top 0.406: 60.15,25.91 59.89,26.16
N$10
  Top 0.61: ICSP.2 54.35,42.86 D2.A
N$11
  Top 0.61: R3.2 R15.1 | R15.1
N$12  (via drill 0.6)
  Top 0.406: LED4.C LED5.A v2.03,80.77 | IC5.5 14.48,68.33 v15.49,67.31
  Bottom 0.406: v15.49,67.31 v2.03,80.77
N$13
  Top 0.305: 0,5 0,0 5,0
N$14
  Top 0.406: R20.1 4.49,76.12 LED4.A
N$15
  Top 0.61: R18.1 R25.2
N$16
  Top 0.813: U$3.4 54.2,80.11 C20.2 54.22,82.71 C18.-
N$17
  Top 0.61: R14.2 36.3,85.52 36.3,85.1 35.45,84.25 C15.1 35.31,83.06 R15.2 34.92,80.62 U$1.3
N$18
  Top 0.406: 60.4,26.04 60.27,26.04 60.02,26.29 60.02,26.16 60.15,26.04
N$19
  Top 0.61: U$3.1 59.48,78.19 59.94,77.72 SJ1.1
N$20
  Top 0.305: 65,0 70,0 70,5
N$21
  Top 0.305: 70,85 70,90 65,90
N$22
  Top 0.305: 5,90 0,90 0,85
N$23  (2 unrouted)
N$27
  Top 0.406: IC5.1 7.37,72.14 7.37,79 9.91,81.53 13.72,81.53 15.49,79.76
  Top 0.61: R25.1 17.27,81.54 15.49,79.76 15.49,78.56 Q3.3
N$29
  Top 0.406: Q3.1 10.8,77.29 10.96,77.13 R19.1 10.92,74.81 10.92,73.66 11.43,73.15 11.43,71.63 12.19,70.86 IC5.7
N$30
  Top 0.406: R21.1 1.95,76.08 LED5.C
N$32
  Top 0.406: R23.1 R22.1 10.2,67.02 8.89,68.33 IC5.4 7.03,67.52 R24.1
RD+
  Top 0.406: U2.4 56.48,25.42 57.23,26.16 R5.2
RD-
  Top 0.406: U2.3 56.48,24.62 57.23,23.88 R4.2
REFPOLSWT
  Top 0.406: U2.31 17.58,24.62 14.17,21.21 4.05,21.21 JP13.2
REFSWT
  Top 0.406: JP13.4 4.05,26.22 U2.29
RESET
  Top 0.406: 56.77,43.76 54.81,45.72 51,45.72 50.01,44.73 50.01,42.46 R6.1 43.99,36.44 43.99,35.48 43,34.49 40.77,34.49 40.38,34.1 U2.13
RXLED
  Top 0.406: U2.8 45.36,28.62 48.64,31.9 57.36,31.9 RX.C
SCK
  Top 0.406: U2.9 44.86,29.42 49.86,34.42 49.86,35.53 ICSP.3
STATUS_LED  (1 unrouted)
SW
  Top 0.61: U$1.1 29.66,80.01 D3.A 23.95,80.01 U$2.P$2
  pour Top (no thermals): 30.46,80.65 21.57,80.65 21.57,78.87 30.46,78.87
SWT  (via drill 0.6)
  Top 0.406: U2.1 43.78,23.02 v44.86,21.95
  Bottom 0.406: v44.86,21.95 44.78,21.95 39.67,27.05 JP1.3
TXLED  (via drill 0.6)
  Top 0.406: U2.12 43,32.82 v43.03,32.84 | v61.32,32.87 61.75,32.87 66.34,37.47 66.34,38.32 TX.C
  Bottom 0.406: v43.03,32.84 61.29,32.84 v61.32,32.87
UCAP
  Top 0.406: U2.6 47.58,27.02 C7.1
VBAT  (via drill 0.6)
  Top 0.406: IC5.2 7.11,70.86 6.1,71.88 6.1,81.25 C25.1 6.21,83.68 6.86,84.33 6.86,86.2 X1.2 | R7.1 v42.95,15.57
  Top 0.61: R13.2 30.27,85.73 30.27,84.04 | 30.27,84.04 U$1.5 | 30.27,84.04 C17.1 23.21,86.04 U$2.P$1 | Q3.4 7.46,85.73 X1.2
  Bottom 0.406: v42.95,15.57 42.95,15.52 44.17,14.3 44.17,11.91 42.9,10.64 21.41,10.64 8.97,23.09 8.97,35.51 3.56,40.92 3.56,49.38 18.54,64.36 18.54,67.46 6.63,79.38 6.63,85.97 X1.2
  pour Top (no thermals): 30.46,83.45 6.07,83.45 6.07,89.8 30.46,89.8
VUSB  (via drill 0.7, 0.8)  (1 unrouted)
  Top 0.406: U2.7 45.65,27.82 48.31,30.48 v50.37,30.48 | R2.1 39.86,88.25 v40.26,88.65
  Top 0.61: C9.1 C8.1 65.13,14.83 64.01,13.72 v58.65,13.72
  Top 0.813: v58.65,13.72 F1.1 | F1.1 57.66,16.86 D4.A | D1.A 57.71,18.8 F1.1
  Bottom 0.406: v50.37,30.48 v58.65,13.72
  Bottom 0.61: v40.26,88.65 47.17,81.74 55.65,81.74 61.75,75.64 61.75,50.22 63.96,48.01 63.96,29.54 58.65,24.23 v58.65,13.72
XTAL1  (1 unrouted)
  Top 0.406: R1.1 32.72,44.59 Q1.1 33.97,46.21 C4.1 | Y2.3 36.57,40.74 R1.1 | R1.1 36.69,39.43 37.21,38.91 37.19,32.83
XTAL2  (1 unrouted)
  Top 0.406: R1.2 42.34,44.44 Q1.2 41.16,46.15 C3.1 | Y2.1 38.57,40.79 R1.2 | R1.2 38.39,39.28 38,38.89 U2.16
XUSB
  Top 0.406: J1.P1 64.29,24.08 64.08,23.88
  Top 0.61: 64.08,23.88 62.56,22.35 F1.2
ZEROSWT
  Top 0.406: 4.1,31.24 JP13.6 14.29,31.33 17.83,27.79 31.34,27.79 U2.27
(copper drawn outside any net)
  shapes: Top area x185, Top circle x4

### Text on the board
Top: - | + | A B S + G | +5v | -5V | GND | 1V23 | Rot Enc | Batt Temp / Sens | Chg> | Done | Dual Slope / Integrating / Voltmeter | LEDs | LCD Conn | Rst | 16MHz | G5 3 T R I | N+ V x x N | DV 3 O I 0 | 1 | < | ICSP | Rx | Tx | 32U4 | UKZN | 2014 | MCU & Power PCB | Design 2 | REV1.0 | DIYElectronics.co.za | R Mawbey | 213560382 | Rambo.co.za | T Eldridge | 211515873